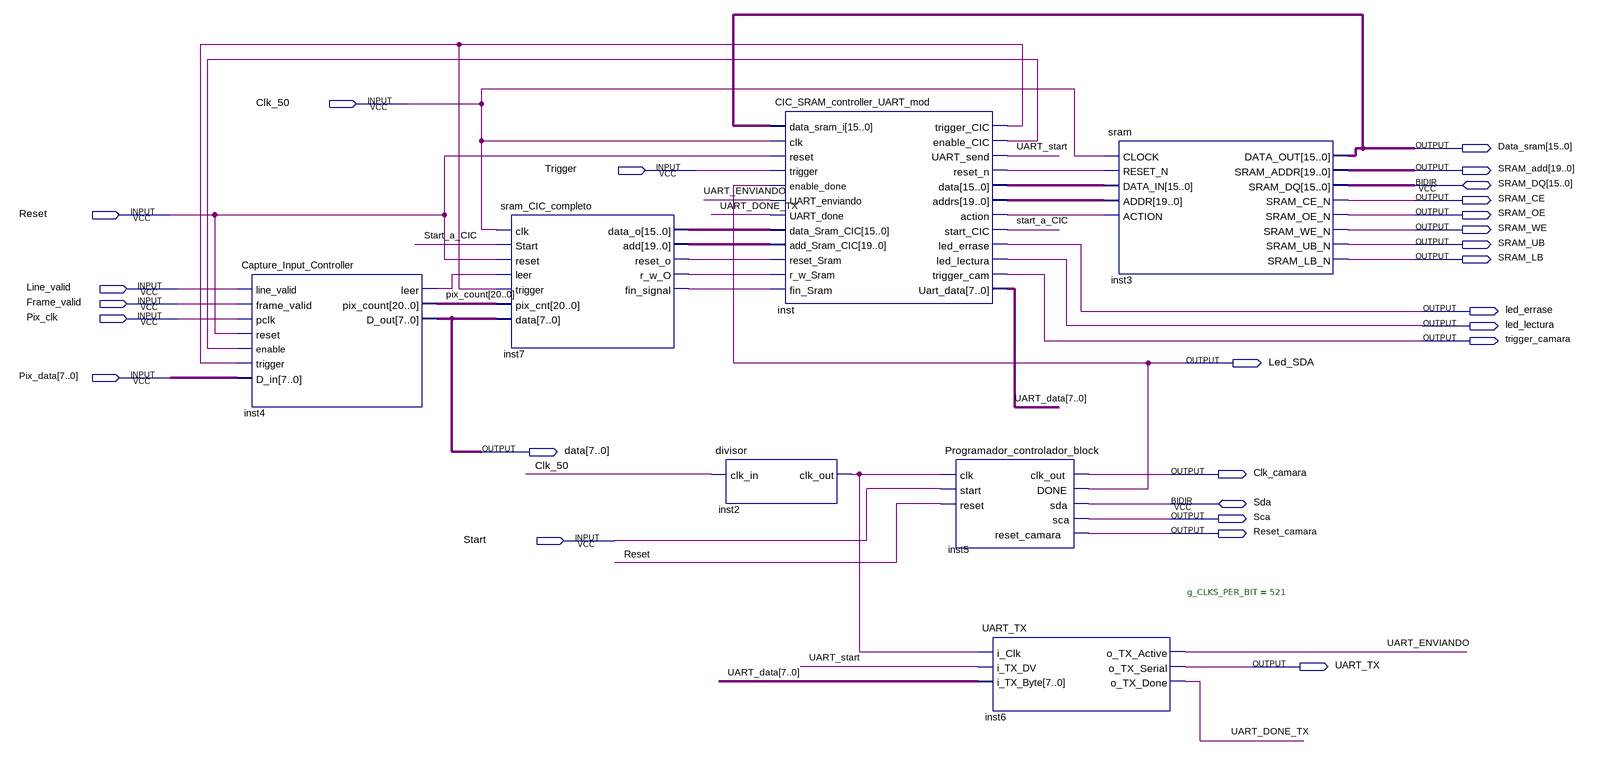
[diagram p0: schematic sheet]
// Quartus schematic todo_junto_UART_2.bdf as structural Verilog: 7 symbols, 26 pins
module todo_junto_UART_2 (
  input  Clk_50,
  input  Trigger,
  input  Reset,
  input  Line_valid,
  input  Frame_valid,
  input  Pix_clk,
  input  [7:0] Pix_data,
  input  Start,
  inout  [15:0] SRAM_DQ,
  inout  Sda,
  output [15:0] Data_sram,
  output [19:0] SRAM_add,
  output SRAM_CE,
  output SRAM_OE,
  output SRAM_WE,
  output SRAM_UB,
  output SRAM_LB,
  output led_errase,
  output led_lectura,
  output trigger_camara,
  output Led_SDA,
  output [7:0] data,
  output Clk_camara,
  output Sca,
  output Reset_camara,
  output UART_TX
);

  wire inst2_clk_out, inst4_leer, inst7_fin_signal, inst7_r_w_o, inst7_reset_o, inst_action, inst_enable_cic,
       inst_reset_n, inst_trigger_cic, Start_a_CIC, UART_DONE_TX, UART_ENVIANDO, UART_start;
  wire [7:0] UART_data;
  wire [15:0] inst7_data_o, inst_data;
  wire [19:0] inst7_add, inst_addrs;
  wire [20:0] pix_count;

  Capture_Input_Controller inst4 (
    .line_valid(Line_valid), .frame_valid(Frame_valid), .pclk(Pix_clk), .reset(Reset),
    .enable(inst_enable_cic), .trigger(inst_trigger_cic), .D_in(Pix_data), .leer(inst4_leer),
    .pix_count(pix_count), .D_out(data));
  sram_CIC_completo inst7 (
    .clk(Clk_50), .Start(Start_a_CIC), .reset(Reset), .leer(inst4_leer), .trigger(inst_trigger_cic),
    .pix_cnt(pix_count), .data(data), .data_o(inst7_data_o), .add(inst7_add), .reset_o(inst7_reset_o),
    .r_w_O(inst7_r_w_o), .fin_signal(inst7_fin_signal));
  divisor inst2 (.clk_in(Clk_50), .clk_out(inst2_clk_out));
  CIC_SRAM_controller_UART_mod inst (
    .data_sram_i(Data_sram), .clk(Clk_50), .reset(Reset), .trigger(Trigger), .enable_done(Led_SDA),
    .UART_enviando(UART_ENVIANDO), .UART_done(UART_DONE_TX), .data_Sram_CIC(inst7_data_o),
    .add_Sram_CIC(inst7_add), .reset_Sram(inst7_reset_o), .r_w_Sram(inst7_r_w_o),
    .fin_Sram(inst7_fin_signal), .trigger_CIC(inst_trigger_cic), .enable_CIC(inst_enable_cic),
    .UART_send(UART_start), .reset_n(inst_reset_n), .data(inst_data), .addrs(inst_addrs),
    .action(inst_action), .start_CIC(Start_a_CIC), .led_errase(led_errase), .led_lectura(led_lectura),
    .trigger_cam(trigger_camara), .Uart_data(UART_data));
  Programador_controlador_block inst5 (
    .clk(inst2_clk_out), .start(Start), .reset(Reset), .clk_out(Clk_camara), .DONE(Led_SDA), .sca(Sca),
    .reset_camara(Reset_camara), .sda(Sda));
  UART_TX #(.g_CLKS_PER_BIT(521)) inst6 (
    .i_Clk(inst2_clk_out), .i_TX_DV(UART_start), .i_TX_Byte(UART_data), .o_TX_Active(UART_ENVIANDO),
    .o_TX_Serial(UART_TX), .o_TX_Done(UART_DONE_TX));
  sram inst3 (
    .CLOCK(Clk_50), .RESET_N(inst_reset_n), .DATA_IN(inst_data), .ADDR(inst_addrs), .ACTION(inst_action),
    .DATA_OUT(Data_sram), .SRAM_ADDR(SRAM_add), .SRAM_CE_N(SRAM_CE), .SRAM_OE_N(SRAM_OE),
    .SRAM_WE_N(SRAM_WE), .SRAM_UB_N(SRAM_UB), .SRAM_LB_N(SRAM_LB), .SRAM_DQ(SRAM_DQ));
endmodule
